# Altium schematic sheet VRAM SIMM TC524258BJ v1.0_Sch_Altium.schdoc
size 301 x 200 mm
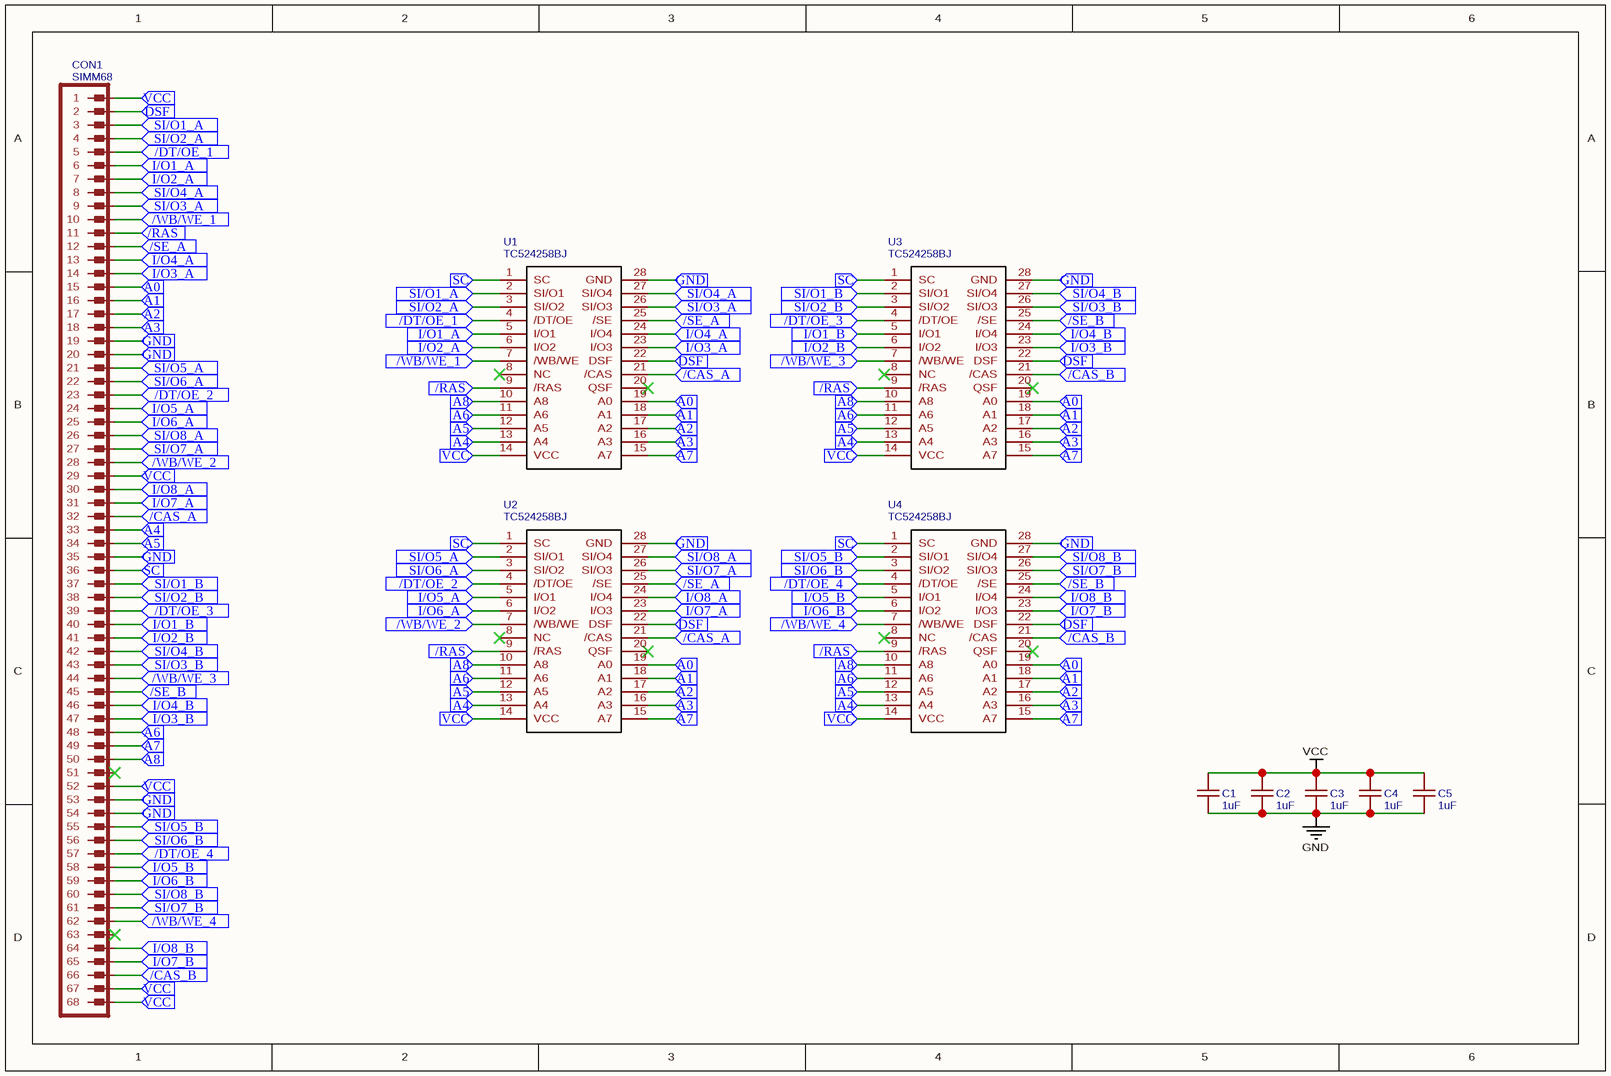
[diagram p0: VRAM SIMM TC524258BJ v1.0_Sch_Altium.schdoc]

## Parts
C1  1uF  [C0603]
C2  1uF  [C0603]
C3  1uF  [C0603]
C4  1uF  [C0603]
C5  1uF  [C0603]
CON1  SIMM68  [SIMM68R]
U1  TC524258BJ  [SOJ28_WIDE]
U2  TC524258BJ  [SOJ28_WIDE]
U3  TC524258BJ  [SOJ28_WIDE]
U4  TC524258BJ  [SOJ28_WIDE]

## Ports
/CAS_A (in), /CAS_B (in), /DT/OE_1 (in), /DT/OE_2 (in), /DT/OE_3 (in), /DT/OE_4 (in), /RAS (in), /SE_A (in), /SE_B (in), /WB/WE_1 (in), /WB/WE_2 (in), /WB/WE_3 (in), /WB/WE_4 (in), A0 (in), A1 (in), A2 (in), A3 (in), A4 (in), A5 (in), A6 (in), A7 (in), A8 (in), DSF (in), GND (in), I/O1_A (in), I/O1_B (in), I/O2_A (in), I/O2_B (in), I/O3_A (in), I/O3_B (in), I/O4_A (in), I/O4_B (in), I/O5_A (in), I/O5_B (in), I/O6_A (in), I/O6_B (in), I/O7_A (in), I/O7_B (in), I/O8_A (in), I/O8_B (in), SC (in), SI/O1_A (in), SI/O1_B (in), SI/O2_A (in), SI/O2_B (in), SI/O3_A (in), SI/O3_B (in), SI/O4_A (in), SI/O4_B (in), SI/O5_A (in), SI/O5_B (in), SI/O6_A (in), SI/O6_B (in), SI/O7_A (in), SI/O7_B (in), SI/O8_A (in), SI/O8_B (in), VCC (in)

## Nets
GND: C1.1 C2.1 C3.1 C4.1 C5.1
VCC: C1.2 C2.2 C3.2 C4.2 C5.2
/CAS_A: CON1.32 U1.21(/CAS) U2.21(/CAS) ; port /CAS_A
/CAS_B: CON1.66 U3.21(/CAS) U4.21(/CAS) ; port /CAS_B
/DT/OE_1: CON1.5 U1.4(/DT/OE) ; port /DT/OE_1
/DT/OE_2: CON1.23 U2.4(/DT/OE) ; port /DT/OE_2
/DT/OE_3: CON1.39 U3.4(/DT/OE) ; port /DT/OE_3
/DT/OE_4: CON1.57 U4.4(/DT/OE) ; port /DT/OE_4
/RAS: CON1.11 U1.9(/RAS) U2.9(/RAS) U3.9(/RAS) U4.9(/RAS) ; port /RAS
/SE_A: CON1.12 U1.25(/SE) U2.25(/SE) ; port /SE_A
/SE_B: CON1.45 U3.25(/SE) U4.25(/SE) ; port /SE_B
/WB/WE_1: CON1.10 U1.7(/WB/WE) ; port /WB/WE_1
/WB/WE_2: CON1.28 U2.7(/WB/WE) ; port /WB/WE_2
/WB/WE_3: CON1.44 U3.7(/WB/WE) ; port /WB/WE_3
/WB/WE_4: CON1.62 U4.7(/WB/WE) ; port /WB/WE_4
A0: CON1.15 U1.19(A0) U2.19(A0) U3.19(A0) U4.19(A0) ; port A0
A1: CON1.16 U1.18(A1) U2.18(A1) U3.18(A1) U4.18(A1) ; port A1
A2: CON1.17 U1.17(A2) U2.17(A2) U3.17(A2) U4.17(A2) ; port A2
A3: CON1.18 U1.16(A3) U2.16(A3) U3.16(A3) U4.16(A3) ; port A3
A4: CON1.33 U1.13(A4) U2.13(A4) U3.13(A4) U4.13(A4) ; port A4
A5: CON1.34 U1.12(A5) U2.12(A5) U3.12(A5) U4.12(A5) ; port A5
A6: CON1.48 U1.11(A6) U2.11(A6) U3.11(A6) U4.11(A6) ; port A6
A7: CON1.49 U1.15(A7) U2.15(A7) U3.15(A7) U4.15(A7) ; port A7
A8: CON1.50 U1.10(A8) U2.10(A8) U3.10(A8) U4.10(A8) ; port A8
DSF: CON1.2 U1.22(DSF) U2.22(DSF) U3.22(DSF) U4.22(DSF) ; port DSF
GND: CON1.19 CON1.20 CON1.35 CON1.53 CON1.54 U1.28(GND) U2.28(GND) U3.28(GND) U4.28(GND) ; port GND  [a separate net that carries the same name]
I/O1_A: CON1.6 U1.5(I/O1) ; port I/O1_A
I/O1_B: CON1.40 U3.5(I/O1) ; port I/O1_B
I/O2_A: CON1.7 U1.6(I/O2) ; port I/O2_A
I/O2_B: CON1.41 U3.6(I/O2) ; port I/O2_B
I/O3_A: CON1.14 U1.23(I/O3) ; port I/O3_A
I/O3_B: CON1.47 U3.23(I/O3) ; port I/O3_B
I/O4_A: CON1.13 U1.24(I/O4) ; port I/O4_A
I/O4_B: CON1.46 U3.24(I/O4) ; port I/O4_B
I/O5_A: CON1.24 U2.5(I/O1) ; port I/O5_A
I/O5_B: CON1.58 U4.5(I/O1) ; port I/O5_B
I/O6_A: CON1.25 U2.6(I/O2) ; port I/O6_A
I/O6_B: CON1.59 U4.6(I/O2) ; port I/O6_B
I/O7_A: CON1.31 U2.23(I/O3) ; port I/O7_A
I/O7_B: CON1.65 U4.23(I/O3) ; port I/O7_B
I/O8_A: CON1.30 U2.24(I/O4) ; port I/O8_A
I/O8_B: CON1.64 U4.24(I/O4) ; port I/O8_B
SC: CON1.36 U1.1(SC) U2.1(SC) U3.1(SC) U4.1(SC) ; port SC
SI/O1_A: CON1.3 U1.2(SI/O1) ; port SI/O1_A
SI/O1_B: CON1.37 U3.2(SI/O1) ; port SI/O1_B
SI/O2_A: CON1.4 U1.3(SI/O2) ; port SI/O2_A
SI/O2_B: CON1.38 U3.3(SI/O2) ; port SI/O2_B
SI/O3_A: CON1.9 U1.26(SI/O3) ; port SI/O3_A
SI/O3_B: CON1.43 U3.26(SI/O3) ; port SI/O3_B
SI/O4_A: CON1.8 U1.27(SI/O4) ; port SI/O4_A
SI/O4_B: CON1.42 U3.27(SI/O4) ; port SI/O4_B
SI/O5_A: CON1.21 U2.2(SI/O1) ; port SI/O5_A
SI/O5_B: CON1.55 U4.2(SI/O1) ; port SI/O5_B
SI/O6_A: CON1.22 U2.3(SI/O2) ; port SI/O6_A
SI/O6_B: CON1.56 U4.3(SI/O2) ; port SI/O6_B
SI/O7_A: CON1.27 U2.26(SI/O3) ; port SI/O7_A
SI/O7_B: CON1.61 U4.26(SI/O3) ; port SI/O7_B
SI/O8_A: CON1.26 U2.27(SI/O4) ; port SI/O8_A
SI/O8_B: CON1.60 U4.27(SI/O4) ; port SI/O8_B
VCC: CON1.1 CON1.29 CON1.52 CON1.67 CON1.68 U1.14(VCC) U2.14(VCC) U3.14(VCC) U4.14(VCC) ; port VCC  [a separate net that carries the same name]

Not connected (* = marked no-connect by the designer): CON1 51* 63*; U1 8(NC)* 20(QSF)*; U2 8(NC)* 20(QSF)*; U3 8(NC)* 20(QSF)*; U4 8(NC)* 20(QSF)*

## Library data of the parts
C1-C5 = 1uF: BOM_Manufacturer Part: CL10A105KP8NNNC; BOM_Manufacturer: SAMSUNG; nameAlias: Capacitance; BOM_Assembly Type: smtWeld; BOM_Paste Type: expand; BOM_Supplier: LCSC; BOM_Supplier Part: C26413; spicePre: C; spiceSymbolName: CL10A105KP8NNNC
CON1 = SIMM68: Contributor: SuperSVGA; spicePre: C; spiceSymbolName: SIMM68
U1-U4 = TC524258BJ: BOM_Manufacturer: Toshiba; Contributor: plasticuser; BOM_Manufacturer Part: TC524258BJ; spicePre: U; spiceSymbolName: TC524258BJ